# Altium schematic sheet SGMII_CONNECTION.SchDoc
size A
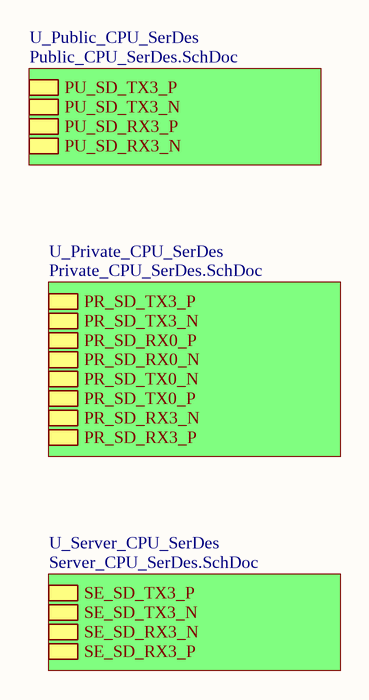
[diagram p0: SGMII_CONNECTION.SchDoc]

## Sub-sheets
U_Private_CPU_SerDes = Private_CPU_SerDes.SchDoc: PR_SD_TX3_P, PR_SD_TX3_N, PR_SD_RX0_P, PR_SD_RX0_N, PR_SD_TX0_N, PR_SD_TX0_P, PR_SD_RX3_N, PR_SD_RX3_P
U_Public_CPU_SerDes = Public_CPU_SerDes.SchDoc: PU_SD_TX3_P, PU_SD_TX3_N, PU_SD_RX3_P, PU_SD_RX3_N
U_Server_CPU_SerDes = Server_CPU_SerDes.SchDoc: SE_SD_TX3_P, SE_SD_TX3_N, SE_SD_RX3_N, SE_SD_RX3_P